# EAGLE design isp_breadboard (EAGLE 6.5.0)
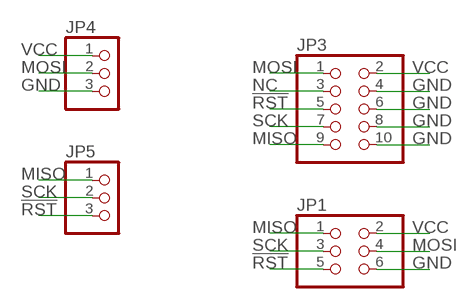
[diagram p0: schematic, sheet 1]

## Parts
JP1  PINHD-2X3  [2X03]
JP3  PINHD-2X5  [2X05]
JP4  PINHD-1X3  [1X03]
JP5  PINHD-1X3  [1X03]

## Nets
!RST: JP1.5 JP3.5 JP5.3
GND: JP1.6 JP3.4 JP3.6 JP3.8 JP3.10 JP4.3
MISO: JP1.1 JP3.9 JP5.1
MOSI: JP1.4 JP3.1 JP4.2
NC: JP3.3
SCK: JP1.3 JP3.7 JP5.2
VCC: JP1.2 JP3.2 JP4.1

## Library data of the parts
JP1 = pinhead:PINHD-2X3: PIN HEADER
JP3 = pinhead:PINHD-2X5: PIN HEADER
JP4 JP5 = pinhead:PINHD-1X3: PIN HEADER

## Net classes
1 Ground: width 0.1 mm, drill 0.2 mm

## Board
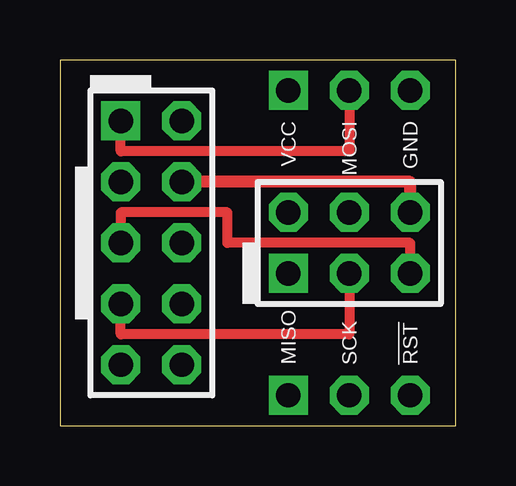
[diagram p1: board, top side]
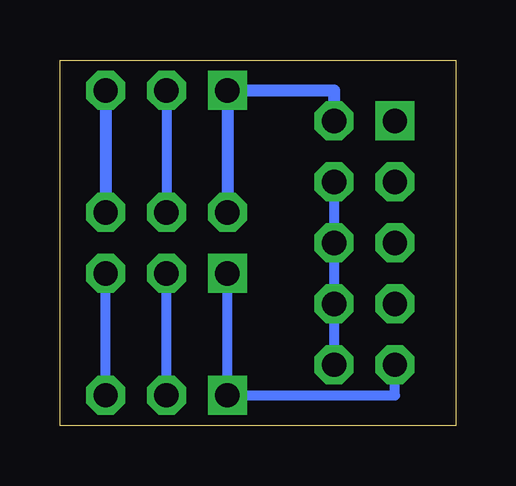
[diagram p2: board, bottom side, seen from below]

Size 16.51 x 15.24 mm. Coordinates in mm from the lower left corner, seen from the top.
Outline: 0,0 16.51,0 16.51,15.24 0,15.24 0,0
Copper layers (1*16): Top 0.035mm / dielectric 1.5mm / Bottom 0.035mm
Design rules "SparkFun *": minimum track width 20mil, minimum drill 20mil, track to track 8mil, track to pad 8mil, pad to pad 8mil, via to via 8mil, smd to smd 8mil, copper to edge 10mil, drill to drill 8mil, minimum pad ring 12mil, minimum via ring 10mil, stop-mask expansion 4mil, vias tented up to drill 25mil, thermal gap 10mil

### Footprints (pad centres in the part's own frame; a part is rotated, then mirrored left to right if it is on the bottom)
2X03 = drill 1.016 square: 1 -2.54,-1.27 | drill 1.016 octagon: 2 -2.54,1.27; 3 0,-1.27; 4 0,1.27; 5 2.54,-1.27; 6 2.54,1.27
2X05 = drill 1.016 square: 1 -5.08,-1.27 | drill 1.016 octagon: 2 -5.08,1.27; 3 -2.54,-1.27; 4 -2.54,1.27; 5 0,-1.27; 6 0,1.27; 7 2.54,-1.27; 8 2.54,1.27; 9 5.08,-1.27; 10 5.08,1.27
1X03 = drill 1.016 square: 1 -2.54,0 | drill 1.016 octagon: 2 0,0; 3 2.54,0

### Placement (x,y rotation side)
JP1  12.06,7.62 0 top
JP3  3.81,7.62 270 top
JP4  12.06,13.97 0 top
JP5  12.06,1.27 0 top

### Tracks (layer width: path | path; a pad name or v marks a point on that pad's centre or on a via)
!RST
  Top 0.406: JP1.5 14.61,7.62 6.99,7.62 6.99,8.89 2.54,8.89 JP3.5
  Bottom 0.406: JP5.3 JP1.5
GND
  Top 0.508: JP1.6 14.61,10.16 JP3.4
  Bottom 0.406: JP3.4 JP3.6 JP3.8 JP3.10
  Bottom 0.508: JP4.3 JP1.6
MISO
  Bottom 0.406: JP1.1 JP5.1 2.54,1.27 JP3.9
MOSI
  Top 0.406: JP4.2 12.06,11.43 2.54,11.43 JP3.1
  Bottom 0.406: JP4.2 JP1.4
SCK
  Top 0.406: JP1.3 12.06,3.81 2.54,3.81 JP3.7
  Bottom 0.406: JP5.2 JP1.3
VCC
  Bottom 0.508: JP1.2 JP4.1 5.08,13.97 JP3.2

### Text on the board
tNames: VCC | MOSI | GND | MISO | SCK | !RST